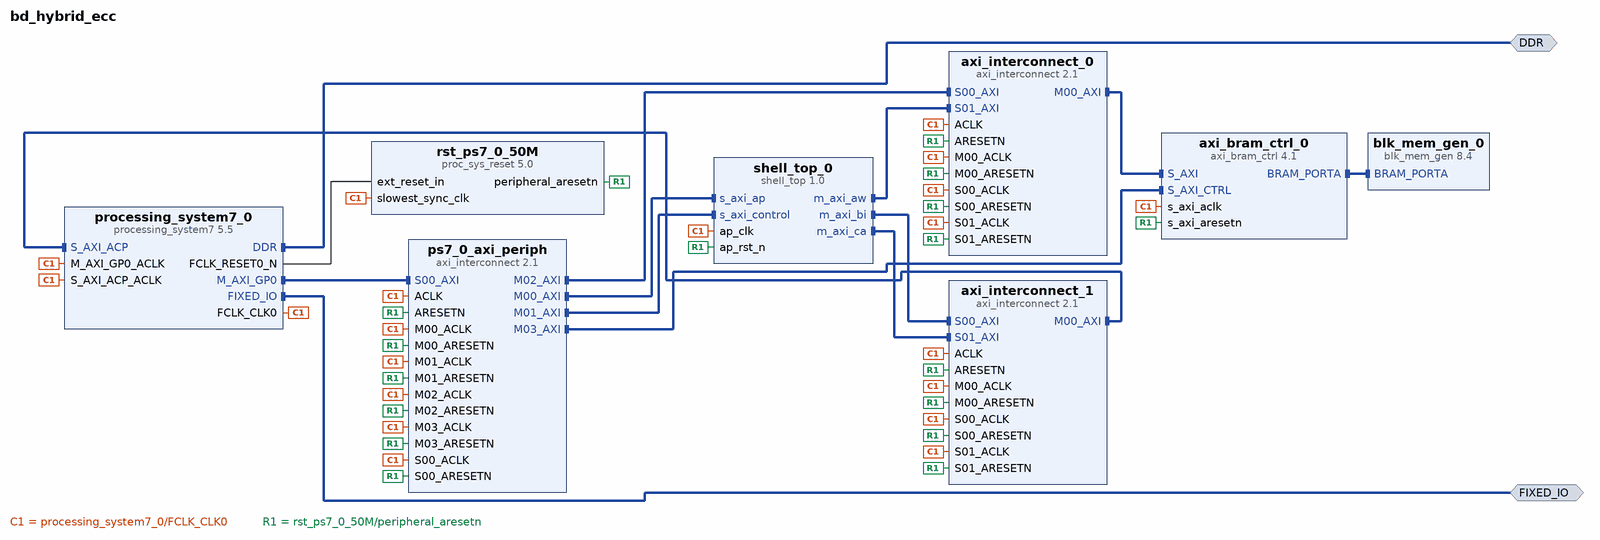
[diagram p0: block diagram of the top level]
# Vivado block design bd_hybrid_ecc, xc7z020clg484-1, Vivado 2023.2
create_bd_design bd_hybrid_ecc

create_bd_intf_port -mode Master -vlnv xilinx.com:interface:ddrx_rtl:1.0 DDR
create_bd_intf_port -mode Master -vlnv xilinx.com:display_processing_system7:fixedio_rtl:1.0 FIXED_IO

create_bd_cell -type ip -vlnv xilinx.com:ip:processing_system7:5.5 processing_system7_0
set_property -dict [list \
  CONFIG.PCW_APU_PERIPHERAL_FREQMHZ 666.666666 \
  CONFIG.PCW_CAN0_CAN0_IO {MIO 46 .. 47} \
  CONFIG.PCW_CAN0_PERIPHERAL_ENABLE 1 \
  CONFIG.PCW_CAN_PERIPHERAL_FREQMHZ 23.8095 \
  CONFIG.PCW_ENET0_PERIPHERAL_ENABLE 0 \
  CONFIG.PCW_FPGA0_PERIPHERAL_FREQMHZ 100 \
  CONFIG.PCW_FPGA1_PERIPHERAL_FREQMHZ 50 \
  CONFIG.PCW_GPIO_MIO_GPIO_ENABLE 1 \
  CONFIG.PCW_GPIO_MIO_GPIO_IO MIO \
  CONFIG.PCW_I2C0_GRP_INT_ENABLE 0 \
  CONFIG.PCW_I2C0_I2C0_IO {MIO 50 .. 51} \
  CONFIG.PCW_I2C0_PERIPHERAL_ENABLE 1 \
  CONFIG.PCW_I2C0_RESET_ENABLE 1 \
  CONFIG.PCW_I2C0_RESET_IO {MIO 13} \
  CONFIG.PCW_I2C_PERIPHERAL_FREQMHZ 111.111115 \
  CONFIG.PCW_I2C_RESET_ENABLE 1 \
  CONFIG.PCW_I2C_RESET_SELECT {Share reset pin} \
  CONFIG.PCW_PERIPHERAL_BOARD_PRESET part0 \
  CONFIG.PCW_PRESET_BANK0_VOLTAGE {LVCMOS 1.8V} \
  CONFIG.PCW_PRESET_BANK1_VOLTAGE {LVCMOS 1.8V} \
  CONFIG.PCW_QSPI_GRP_FBCLK_ENABLE 1 \
  CONFIG.PCW_QSPI_GRP_FBCLK_IO {MIO 8} \
  CONFIG.PCW_QSPI_GRP_SINGLE_SS_ENABLE 1 \
  CONFIG.PCW_QSPI_GRP_SINGLE_SS_IO {MIO 1 .. 6} \
  CONFIG.PCW_QSPI_PERIPHERAL_ENABLE 1 \
  CONFIG.PCW_QSPI_QSPI_IO {MIO 1 .. 6} \
  CONFIG.PCW_SD0_GRP_CD_ENABLE 1 \
  CONFIG.PCW_SD0_GRP_CD_IO {MIO 0} \
  CONFIG.PCW_SD0_GRP_WP_ENABLE 1 \
  CONFIG.PCW_SD0_GRP_WP_IO {MIO 15} \
  CONFIG.PCW_SD0_PERIPHERAL_ENABLE 1 \
  CONFIG.PCW_SD0_SD0_IO {MIO 40 .. 45} \
  CONFIG.PCW_SDIO_PERIPHERAL_FREQMHZ 50 \
  CONFIG.PCW_SINGLE_QSPI_DATA_MODE x4 \
  CONFIG.PCW_TTC0_PERIPHERAL_ENABLE 1 \
  CONFIG.PCW_TTC0_TTC0_IO EMIO \
  CONFIG.PCW_UART1_PERIPHERAL_ENABLE 1 \
  CONFIG.PCW_UART1_UART1_IO {MIO 48 .. 49} \
  CONFIG.PCW_UART_PERIPHERAL_FREQMHZ 50 \
  CONFIG.PCW_UIPARAM_DDR_FREQ_MHZ 533.333333 \
  CONFIG.PCW_UIPARAM_DDR_PARTNO {MT41J256M8 HX-15E} \
  CONFIG.PCW_USB0_PERIPHERAL_ENABLE 0 \
  CONFIG.PCW_USB_RESET_ENABLE 1 \
  CONFIG.PCW_USE_S_AXI_ACP 1 \
  CONFIG.preset ZC702 \
] [get_bd_cells processing_system7_0]
# 499 more settings of processing_system7_0 are not shown: defaults, MIO pin electricals, DDR timing, and values the tool derives
create_bd_cell -type ip -vlnv xilinx.com:hls:shell_top:1.0 shell_top_0
create_bd_cell -type ip -vlnv xilinx.com:ip:axi_interconnect:2.1 ps7_0_axi_periph
set_property -dict {CONFIG.NUM_MI 4} [get_bd_cells ps7_0_axi_periph]
create_bd_cell -type ip -vlnv xilinx.com:ip:proc_sys_reset:5.0 rst_ps7_0_50M
create_bd_cell -type ip -vlnv xilinx.com:ip:blk_mem_gen:8.4 blk_mem_gen_0
create_bd_cell -type ip -vlnv xilinx.com:ip:axi_bram_ctrl:4.1 axi_bram_ctrl_0
set_property -dict {CONFIG.ECC_ONOFF_RESET_VALUE 1 CONFIG.SINGLE_PORT_BRAM 1 CONFIG.USE_ECC 1} [get_bd_cells axi_bram_ctrl_0]
create_bd_cell -type ip -vlnv xilinx.com:ip:axi_interconnect:2.1 axi_interconnect_0
set_property -dict {CONFIG.NUM_MI 1 CONFIG.NUM_SI 2} [get_bd_cells axi_interconnect_0]
create_bd_cell -type ip -vlnv xilinx.com:ip:axi_interconnect:2.1 axi_interconnect_1
set_property -dict {CONFIG.NUM_MI 1 CONFIG.NUM_SI 2} [get_bd_cells axi_interconnect_1]

# ---- connections ----

connect_bd_intf_net [get_bd_intf_pins axi_bram_ctrl_0/BRAM_PORTA] [get_bd_intf_pins blk_mem_gen_0/BRAM_PORTA]
connect_bd_intf_net [get_bd_intf_pins axi_interconnect_0/M00_AXI] [get_bd_intf_pins axi_bram_ctrl_0/S_AXI]
connect_bd_intf_net [get_bd_intf_pins axi_interconnect_1/M00_AXI] [get_bd_intf_pins processing_system7_0/S_AXI_ACP]
connect_bd_intf_net [get_bd_intf_ports DDR] [get_bd_intf_pins processing_system7_0/DDR]
connect_bd_intf_net [get_bd_intf_ports FIXED_IO] [get_bd_intf_pins processing_system7_0/FIXED_IO]
connect_bd_intf_net [get_bd_intf_pins processing_system7_0/M_AXI_GP0] [get_bd_intf_pins ps7_0_axi_periph/S00_AXI]
connect_bd_intf_net [get_bd_intf_pins ps7_0_axi_periph/M00_AXI] [get_bd_intf_pins shell_top_0/s_axi_ap]
connect_bd_intf_net [get_bd_intf_pins ps7_0_axi_periph/M01_AXI] [get_bd_intf_pins shell_top_0/s_axi_control]
connect_bd_intf_net [get_bd_intf_pins ps7_0_axi_periph/M02_AXI] [get_bd_intf_pins axi_interconnect_0/S00_AXI]
connect_bd_intf_net [get_bd_intf_pins ps7_0_axi_periph/M03_AXI] [get_bd_intf_pins axi_bram_ctrl_0/S_AXI_CTRL]
connect_bd_intf_net [get_bd_intf_pins shell_top_0/m_axi_aw] [get_bd_intf_pins axi_interconnect_0/S01_AXI]
connect_bd_intf_net [get_bd_intf_pins shell_top_0/m_axi_bi] [get_bd_intf_pins axi_interconnect_1/S00_AXI]
connect_bd_intf_net [get_bd_intf_pins shell_top_0/m_axi_ca] [get_bd_intf_pins axi_interconnect_1/S01_AXI]
connect_bd_net [get_bd_pins processing_system7_0/FCLK_CLK0] \
  [get_bd_pins processing_system7_0/M_AXI_GP0_ACLK] [get_bd_pins ps7_0_axi_periph/S00_ACLK] \
  [get_bd_pins rst_ps7_0_50M/slowest_sync_clk] [get_bd_pins ps7_0_axi_periph/M00_ACLK] [get_bd_pins ps7_0_axi_periph/ACLK] \
  [get_bd_pins ps7_0_axi_periph/M01_ACLK] [get_bd_pins axi_bram_ctrl_0/s_axi_aclk] [get_bd_pins axi_interconnect_0/M00_ACLK] \
  [get_bd_pins axi_interconnect_0/ACLK] [get_bd_pins axi_interconnect_0/S00_ACLK] [get_bd_pins ps7_0_axi_periph/M02_ACLK] \
  [get_bd_pins axi_interconnect_0/S01_ACLK] [get_bd_pins axi_interconnect_1/ACLK] [get_bd_pins axi_interconnect_1/M00_ACLK] \
  [get_bd_pins processing_system7_0/S_AXI_ACP_ACLK] [get_bd_pins axi_interconnect_1/S00_ACLK] \
  [get_bd_pins axi_interconnect_1/S01_ACLK] [get_bd_pins ps7_0_axi_periph/M03_ACLK] [get_bd_pins shell_top_0/ap_clk]
connect_bd_net [get_bd_pins processing_system7_0/FCLK_RESET0_N] [get_bd_pins rst_ps7_0_50M/ext_reset_in]
connect_bd_net [get_bd_pins rst_ps7_0_50M/peripheral_aresetn] \
  [get_bd_pins ps7_0_axi_periph/S00_ARESETN] [get_bd_pins ps7_0_axi_periph/M00_ARESETN] \
  [get_bd_pins ps7_0_axi_periph/ARESETN] [get_bd_pins ps7_0_axi_periph/M01_ARESETN] \
  [get_bd_pins axi_bram_ctrl_0/s_axi_aresetn] [get_bd_pins axi_interconnect_0/M00_ARESETN] \
  [get_bd_pins axi_interconnect_0/ARESETN] [get_bd_pins axi_interconnect_0/S00_ARESETN] \
  [get_bd_pins ps7_0_axi_periph/M02_ARESETN] [get_bd_pins axi_interconnect_0/S01_ARESETN] \
  [get_bd_pins axi_interconnect_1/ARESETN] [get_bd_pins axi_interconnect_1/M00_ARESETN] \
  [get_bd_pins axi_interconnect_1/S00_ARESETN] [get_bd_pins axi_interconnect_1/S01_ARESETN] \
  [get_bd_pins ps7_0_axi_periph/M03_ARESETN] [get_bd_pins shell_top_0/ap_rst_n]
set_property HDL_ATTRIBUTE.BMM_INFO_PROCESSOR {arm > bd_hybrid_ecc axi_bram_ctrl_0} [get_bd_cells processing_system7_0]
set_property HDL_ATTRIBUTE.KEEP_HIERARCHY yes [get_bd_cells processing_system7_0]
set_property HDL_ATTRIBUTE.BMM_INFO_ADDRESS_SPACE {byte  0x40020000 40 > bd_hybrid_ecc blk_mem_gen_0} [get_bd_cells axi_bram_ctrl_0]
set_property HDL_ATTRIBUTE.KEEP_HIERARCHY yes [get_bd_cells axi_bram_ctrl_0]

# ---- address map ----
assign_bd_address -offset 0x40000000 -range 8K -target_address_space [get_bd_addr_spaces processing_system7_0/Data] [get_bd_addr_segs shell_top_0/s_axi_ap/Reg]
assign_bd_address -offset 0x40010000 -range 8K -target_address_space [get_bd_addr_spaces processing_system7_0/Data] [get_bd_addr_segs shell_top_0/s_axi_control/Reg]
assign_bd_address -offset 0x40020000 -range 4K -target_address_space [get_bd_addr_spaces processing_system7_0/Data] [get_bd_addr_segs axi_bram_ctrl_0/S_AXI/Mem0]
assign_bd_address -offset 0x76000000 -range 64K -target_address_space [get_bd_addr_spaces processing_system7_0/Data] [get_bd_addr_segs axi_bram_ctrl_0/S_AXI_CTRL/Reg]
assign_bd_address -offset 0x40020000 -range 4K -target_address_space [get_bd_addr_spaces shell_top_0/Data_m_axi_aw] [get_bd_addr_segs axi_bram_ctrl_0/S_AXI/Mem0]
assign_bd_address -offset 0x00000000 -range 1G -target_address_space [get_bd_addr_spaces shell_top_0/Data_m_axi_bi] [get_bd_addr_segs processing_system7_0/S_AXI_ACP/ACP_DDR_LOWOCM]
assign_bd_address -offset 0xFC000000 -range 16M -target_address_space [get_bd_addr_spaces shell_top_0/Data_m_axi_bi] [get_bd_addr_segs processing_system7_0/S_AXI_ACP/ACP_QSPI_LINEAR]
exclude_bd_addr_seg -offset 0x40000000 -range 1G -target_address_space [get_bd_addr_spaces shell_top_0/Data_m_axi_bi] [get_bd_addr_segs processing_system7_0/S_AXI_ACP/ACP_M_AXI_GP0]
exclude_bd_addr_seg -offset 0xE0000000 -range 4M -target_address_space [get_bd_addr_spaces shell_top_0/Data_m_axi_bi] [get_bd_addr_segs processing_system7_0/S_AXI_ACP/ACP_IOP]
assign_bd_address -offset 0x00000000 -range 1G -target_address_space [get_bd_addr_spaces shell_top_0/Data_m_axi_ca] [get_bd_addr_segs processing_system7_0/S_AXI_ACP/ACP_DDR_LOWOCM]
assign_bd_address -offset 0xFC000000 -range 16M -target_address_space [get_bd_addr_spaces shell_top_0/Data_m_axi_ca] [get_bd_addr_segs processing_system7_0/S_AXI_ACP/ACP_QSPI_LINEAR]
exclude_bd_addr_seg -offset 0x40000000 -range 1G -target_address_space [get_bd_addr_spaces shell_top_0/Data_m_axi_ca] [get_bd_addr_segs processing_system7_0/S_AXI_ACP/ACP_M_AXI_GP0]
exclude_bd_addr_seg -offset 0xE0000000 -range 4M -target_address_space [get_bd_addr_spaces shell_top_0/Data_m_axi_ca] [get_bd_addr_segs processing_system7_0/S_AXI_ACP/ACP_IOP]

validate_bd_design
save_bd_design
